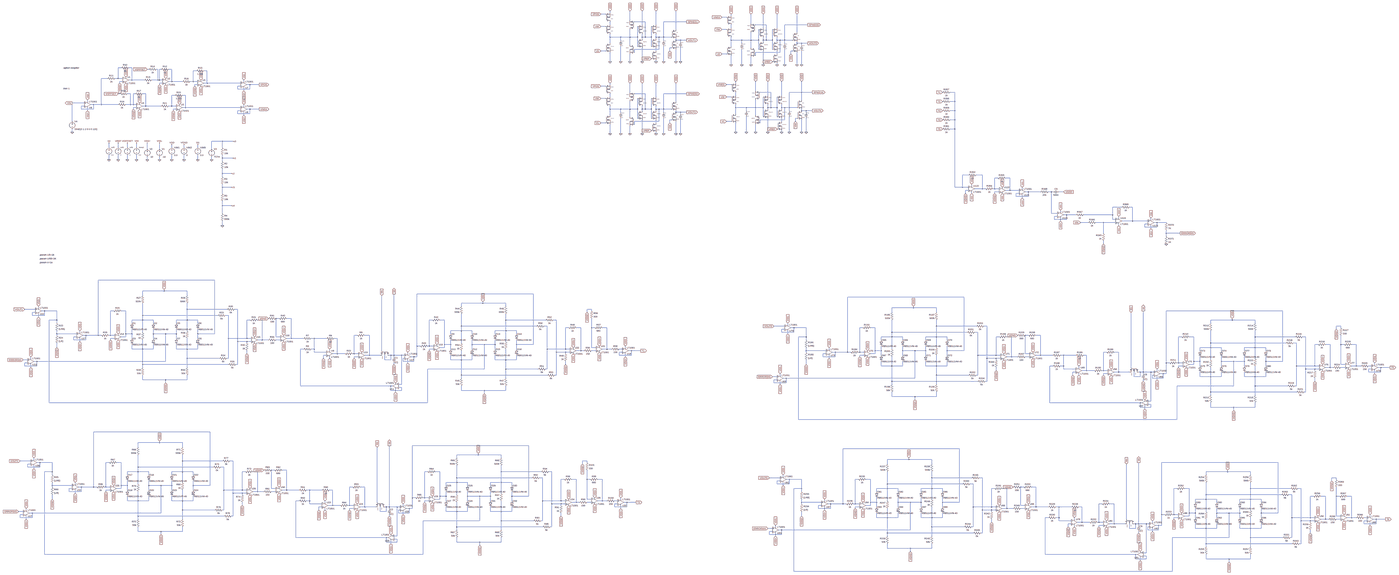
[diagram p0: schematic OZ_8_bounded_curves.asc, whole sheet]
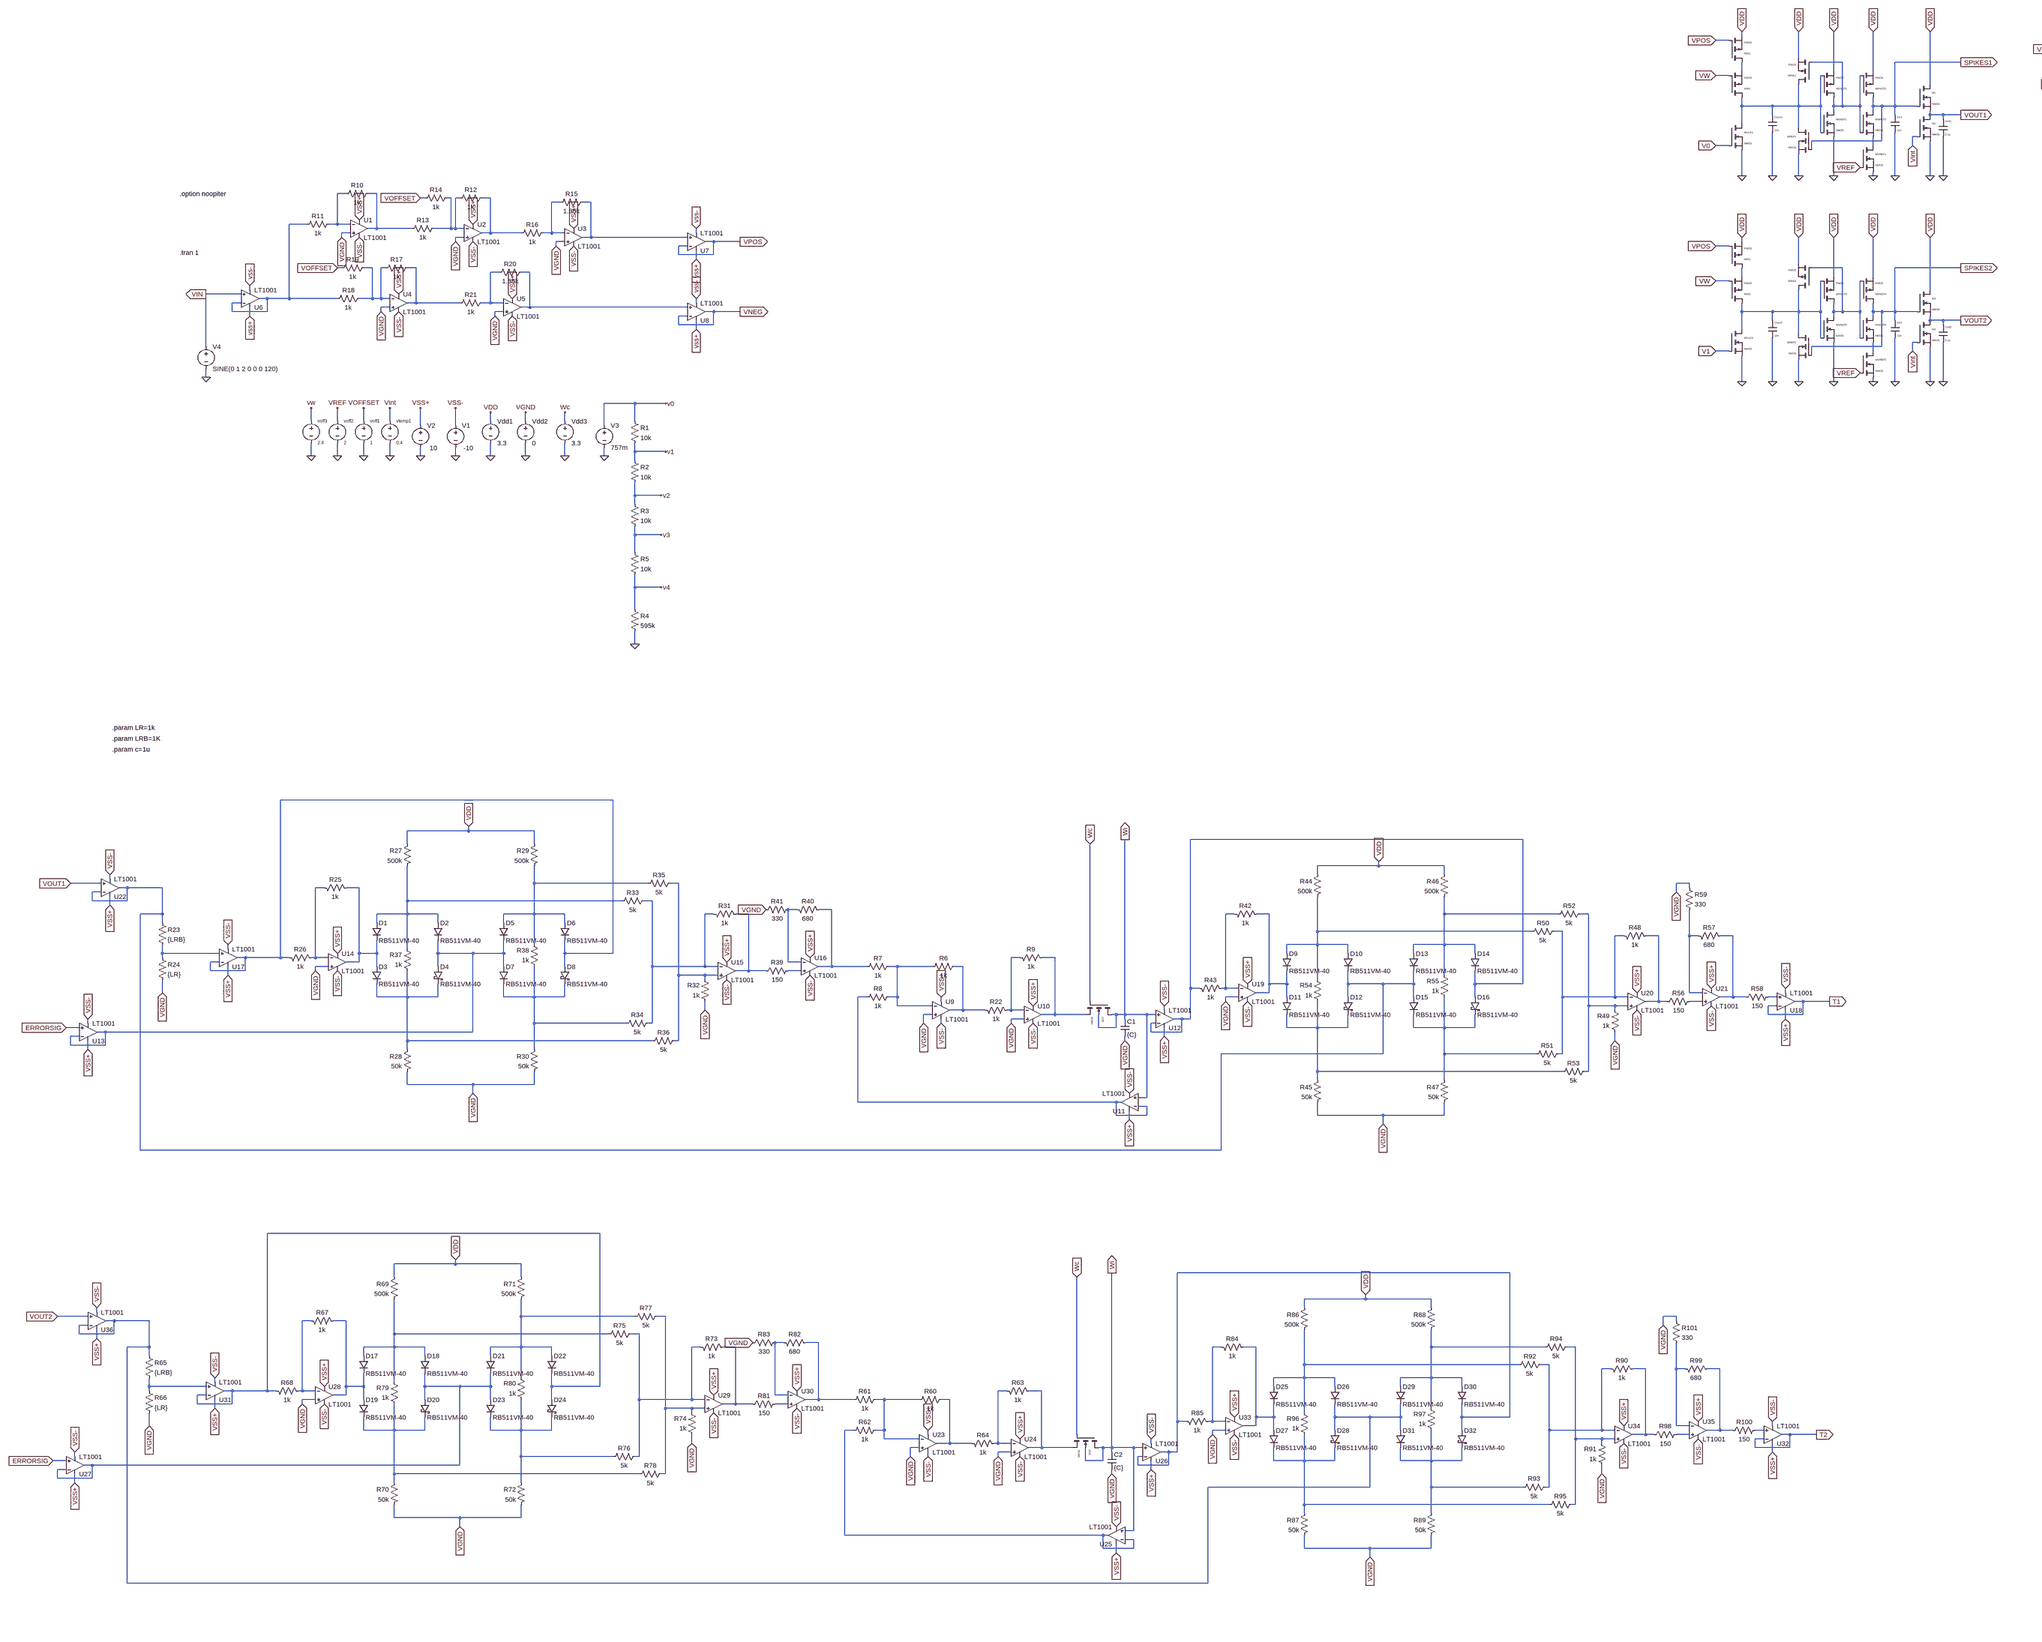
[diagram p1: schematic OZ_8_bounded_curves.asc, part, row 1 of 1, column 1 of 2]
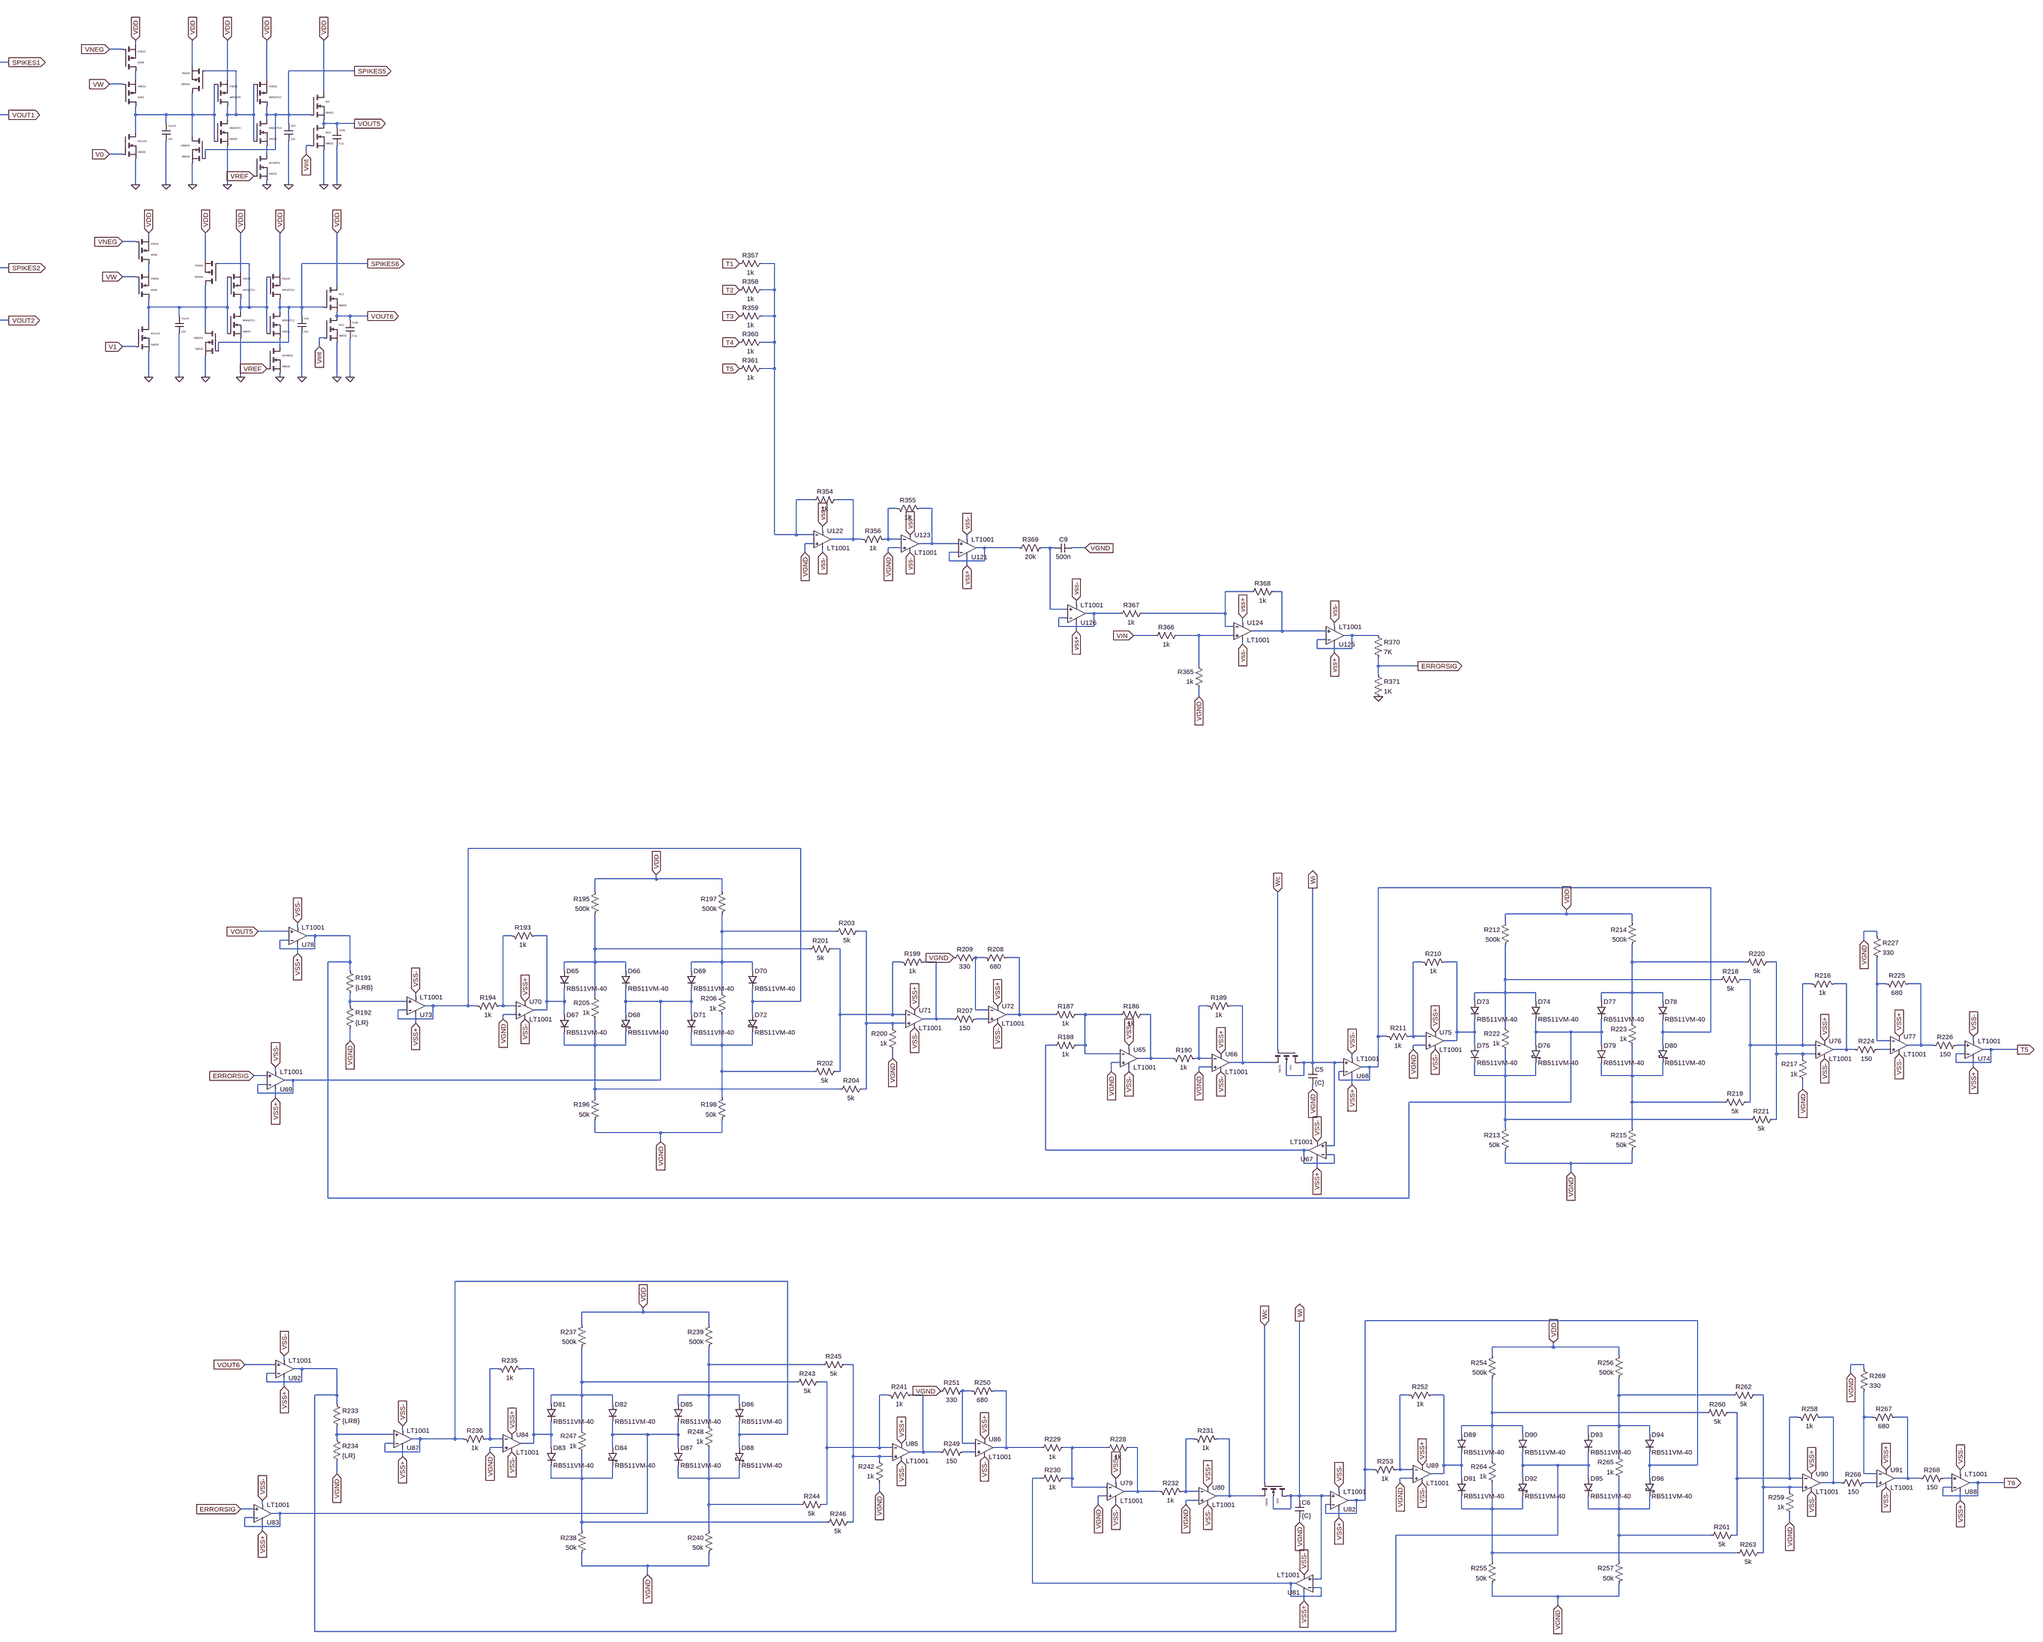
[diagram p2: schematic OZ_8_bounded_curves.asc, part, row 1 of 1, column 2 of 2]
* OZ_8_bounded_curves.asc
vtemp1 Vint 0 0.4
Vdd1 VDD 0 3.3
V1 VSS- 0 -10
V2 VSS+ 0 10
voff1 VOFFSET 0 1
voff2 VREF 0 2
voff3 vw 0 2.4
Vdd2 VGND 0 0
XU1 VGND N009 VSS+ VSS- N010 LT1001  ; pins In+ In- V+ V- OUT
R10 N010 N009 1k
R11 N009 N015 1k
XU2 VGND N011 VSS+ VSS- N012 LT1001  ; pins In+ In- V+ V- OUT
R12 N012 N011 1k
R13 N011 N010 1k
R14 N011 VOFFSET 1k
XU3 VGND N013 VSS+ VSS- N014 LT1001  ; pins In+ In- V+ V- OUT
R15 N014 N013 1.65k
R16 N013 N012 1k
XU4 VGND N018 VSS+ VSS- N019 LT1001  ; pins In+ In- V+ V- OUT
R17 N019 N018 1k
R18 N018 N015 1k
R19 N018 VOFFSET 1k
XU5 VGND N021 VSS+ VSS- N022 LT1001  ; pins In+ In- V+ V- OUT
R20 N022 N021 1.65k
R21 N021 N019 1k
XU6 VIN N015 VSS+ VSS- N015 LT1001  ; pins In+ In- V+ V- OUT
XU7 N014 VPOS VSS+ VSS- VPOS LT1001  ; pins In+ In- V+ V- OUT
XU8 N022 VNEG VSS+ VSS- VNEG LT1001  ; pins In+ In- V+ V- OUT
MW1 N005 vw N002 N002 PMOS
Csyn1 N005 0 10n V=4 Irms=162m Rser=0.395426 Lser=0 mfg="KEMET" pn="C0402C103K7PAC" type="X5R" IC=0
Ck1 SPIKES1 0 10n
MPNOT1 N001 N005 VDD VDD PMOS
MNNOT1 N001 N005 0 0 NMOS
MVREF1 N007 VREF 0 0 NMOS
MREF1 N005 SPIKES1 0 0 NMOS
MVLK1 N005 V0 0 0 NMOS
MINA1 N005 N001 VDD VDD PMOS
MIN1 N002 VPOS VDD VDD PMOS
MPNOT2 SPIKES1 N001 VDD VDD PMOS
MNNOT2 SPIKES1 N001 N007 N007 NMOS
M1 VDD SPIKES1 VOUT1 VOUT1 NMOS
M2 VOUT1 Vint 0 0 NMOS
Cint1 VOUT1 0 0.1µ
MW2 N026 vw N024 N024 PMOS
Csyn2 N026 0 10n V=4 Irms=162m Rser=0.395426 Lser=0 mfg="KEMET" pn="C0402C103K7PAC" type="X5R" IC=0
Ck2 SPIKES2 0 10n
MPNOT3 N020 N026 VDD VDD PMOS
MNNOT3 N020 N026 0 0 NMOS
MVREF2 N028 VREF 0 0 NMOS
MREF2 N026 SPIKES2 0 0 NMOS
MVLK2 N026 V1 0 0 NMOS
MINA2 N026 N020 VDD VDD PMOS
MIN2 N024 VPOS VDD VDD PMOS
MPNOT4 SPIKES2 N020 VDD VDD PMOS
MNNOT4 SPIKES2 N020 N028 N028 NMOS
M3 VDD SPIKES2 VOUT2 VOUT2 NMOS
M4 VOUT2 Vint 0 0 NMOS
Cint2 VOUT2 0 0.1µ
MW5 N006 vw N004 N004 PMOS
Csyn5 N006 0 10n V=4 Irms=162m Rser=0.395426 Lser=0 mfg="KEMET" pn="C0402C103K7PAC" type="X5R" IC=0
Ck5 SPIKES5 0 10n
MPNOT9 N003 N006 VDD VDD PMOS
MNNOT9 N003 N006 0 0 NMOS
MVREF5 N008 VREF 0 0 NMOS
MREF5 N006 SPIKES5 0 0 NMOS
MVLK5 N006 V0 0 0 NMOS
MINA5 N006 N003 VDD VDD PMOS
MIN5 N004 VNEG VDD VDD PMOS
MPNOT10 SPIKES5 N003 VDD VDD PMOS
MNNOT10 SPIKES5 N003 N008 N008 NMOS
M9 VDD SPIKES5 VOUT5 VOUT5 NMOS
M10 VOUT5 Vint 0 0 NMOS
Cint5 VOUT5 0 0.1µ
MW6 N025 vw N023 N023 PMOS
Csyn6 N025 0 10n V=4 Irms=162m Rser=0.395426 Lser=0 mfg="KEMET" pn="C0402C103K7PAC" type="X5R" IC=0
Ck6 SPIKES6 0 10n
MPNOT11 N016 N025 VDD VDD PMOS
MNNOT11 N016 N025 0 0 NMOS
MVREF6 N027 VREF 0 0 NMOS
MREF6 N025 SPIKES6 0 0 NMOS
MVLK6 N025 V1 0 0 NMOS
MINA6 N025 N016 VDD VDD PMOS
MIN6 N023 VNEG VDD VDD PMOS
MPNOT12 SPIKES6 N016 VDD VDD PMOS
MNNOT12 SPIKES6 N016 N027 N027 NMOS
M11 VDD SPIKES6 VOUT6 VOUT6 NMOS
M12 VOUT6 Vint 0 0 NMOS
Cint6 VOUT6 0 0.1µ
V3 V0 0 757m
R1 V0 V1 10k
R2 V1 v2 10k
R3 v2 v3 10k
R4 v4 0 595k
R5 v3 v4 10k
V4 VIN 0 SINE(0 1 2 0 0 0 120)
XU121 N031 N032 VSS+ VSS- N032 LT1001  ; pins In+ In- V+ V- OUT
XU122 VGND N017 VSS+ VSS- N029 LT1001  ; pins In+ In- V+ V- OUT
R354 N029 N017 1k
XU123 VGND N030 VSS+ VSS- N031 LT1001  ; pins In+ In- V+ V- OUT
R355 N030 N031 1k
R356 N029 N030 1k
R357 N017 T1 1k
R358 N017 T2 1k
R359 N017 T3 1k
R360 N017 T4 1k
R361 N017 T5 1k
M17 Wi Wc N072 Wi NMOS
C1 Wi VGND {C} IC=0
XU9 VGND N080 VSS+ VSS- N081 LT1001  ; pins In+ In- V+ V- OUT
R6 N081 N080 1k
R7 N080 N051 1k
R8 N080 N090 1k
XU10 VGND N071 VSS+ VSS- N072 LT1001  ; pins In+ In- V+ V- OUT
R9 N071 N072 1k
R22 N081 N071 1k
XU11 Wi N090 VSS+ VSS- N090 LT1001  ; pins In+ In- V+ V- OUT
XU12 Wi N040 VSS+ VSS- N040 LT1001  ; pins In+ In- V+ V- OUT
R23 N044 N069 {LRB}
R24 N069 VGND {LR}
XU13 ERRORSIG N070 VSS+ VSS- N070 LT1001  ; pins In+ In- V+ V- OUT
D1 N048 N046 RB511VM-40
XU14 VGND N045 VSS+ VSS- N046 LT1001  ; pins In+ In- V+ V- OUT
R25 N045 N046 1k
R26 N039 N045 1k
D2 N048 N070 RB511VM-40
D3 N046 N088 RB511VM-40
D4 N070 N088 RB511VM-40
R27 VDD N048 500k
R28 N088 VGND 50k
D5 N042 N070 RB511VM-40
D6 N042 N039 RB511VM-40
D7 N070 N089 RB511VM-40
D8 N039 N089 RB511VM-40
R29 VDD N042 500k
R30 N089 VGND 50k
XU15 N043 N049 VSS+ VSS- N052 LT1001  ; pins In+ In- V+ V- OUT
R31 N049 N052 1k
R32 VGND N043 1k
R33 N049 N048 5k
R34 N049 N089 5k
R35 N043 N042 5k
R36 N043 N088 5k
R37 N088 N048 1k
R38 N089 N042 1k
R39 N052 N082 150
XU16 N082 N050 VSS+ VSS- N051 LT1001  ; pins In+ In- V+ V- OUT
R40 N050 N051 680
R41 VGND N050 330
XU17 N069 N039 VSS+ VSS- N039 LT1001  ; pins In+ In- V+ V- OUT
XU18 N091 T1 VSS+ VSS- T1 LT1001  ; pins In+ In- V+ V- OUT
D9 N057 N054 RB511VM-40
XU19 VGND N053 VSS+ VSS- N054 LT1001  ; pins In+ In- V+ V- OUT
R42 N053 N054 1k
R43 N040 N053 1k
D10 N057 N044 RB511VM-40
D11 N054 N100 RB511VM-40
D12 N044 N100 RB511VM-40
R44 VDD N057 500k
R45 N100 VGND 50k
D13 N055 N044 RB511VM-40
D14 N055 N040 RB511VM-40
D15 N044 N101 RB511VM-40
D16 N040 N101 RB511VM-40
R46 VDD N055 500k
R47 N101 VGND 50k
XU20 N056 N058 VSS+ VSS- N061 LT1001  ; pins In+ In- V+ V- OUT
R48 N058 N061 1k
R49 VGND N056 1k
R50 N058 N057 5k
R51 N058 N101 5k
R52 N056 N055 5k
R53 N056 N100 5k
R54 N100 N057 1k
R55 N101 N055 1k
R56 N061 N092 150
XU21 N092 N062 VSS+ VSS- N063 LT1001  ; pins In+ In- V+ V- OUT
R57 N062 N063 680
R58 N063 N091 150
R59 VGND N062 330
XU22 VOUT1 N044 VSS+ VSS- N044 LT1001  ; pins In+ In- V+ V- OUT
M18 Wi Wc N142 Wi NMOS
C2 Wi VGND {C} IC=0
XU23 VGND N150 VSS+ VSS- N151 LT1001  ; pins In+ In- V+ V- OUT
R60 N151 N150 1k
R61 N150 N121 1k
R62 N150 N160 1k
XU24 VGND N141 VSS+ VSS- N142 LT1001  ; pins In+ In- V+ V- OUT
R63 N141 N142 1k
R64 N151 N141 1k
XU25 Wi N160 VSS+ VSS- N160 LT1001  ; pins In+ In- V+ V- OUT
XU26 Wi N110 VSS+ VSS- N110 LT1001  ; pins In+ In- V+ V- OUT
R65 N114 N139 {LRB}
R66 N139 VGND {LR}
XU27 ERRORSIG N140 VSS+ VSS- N140 LT1001  ; pins In+ In- V+ V- OUT
D17 N118 N116 RB511VM-40
XU28 VGND N115 VSS+ VSS- N116 LT1001  ; pins In+ In- V+ V- OUT
R67 N115 N116 1k
R68 N109 N115 1k
D18 N118 N140 RB511VM-40
D19 N116 N158 RB511VM-40
D20 N140 N158 RB511VM-40
R69 VDD N118 500k
R70 N158 VGND 50k
D21 N112 N140 RB511VM-40
D22 N112 N109 RB511VM-40
D23 N140 N159 RB511VM-40
D24 N109 N159 RB511VM-40
R71 VDD N112 500k
R72 N159 VGND 50k
XU29 N113 N119 VSS+ VSS- N122 LT1001  ; pins In+ In- V+ V- OUT
R73 N119 N122 1k
R74 VGND N113 1k
R75 N119 N118 5k
R76 N119 N159 5k
R77 N113 N112 5k
R78 N113 N158 5k
R79 N158 N118 1k
R80 N159 N112 1k
R81 N122 N152 150
XU30 N152 N120 VSS+ VSS- N121 LT1001  ; pins In+ In- V+ V- OUT
R82 N120 N121 680
R83 VGND N120 330
XU31 N139 N109 VSS+ VSS- N109 LT1001  ; pins In+ In- V+ V- OUT
XU32 N161 T2 VSS+ VSS- T2 LT1001  ; pins In+ In- V+ V- OUT
D25 N127 N124 RB511VM-40
XU33 VGND N123 VSS+ VSS- N124 LT1001  ; pins In+ In- V+ V- OUT
R84 N123 N124 1k
R85 N110 N123 1k
D26 N127 N114 RB511VM-40
D27 N124 N170 RB511VM-40
D28 N114 N170 RB511VM-40
R86 VDD N127 500k
R87 N170 VGND 50k
D29 N125 N114 RB511VM-40
D30 N125 N110 RB511VM-40
D31 N114 N171 RB511VM-40
D32 N110 N171 RB511VM-40
R88 VDD N125 500k
R89 N171 VGND 50k
XU34 N126 N128 VSS+ VSS- N131 LT1001  ; pins In+ In- V+ V- OUT
R90 N128 N131 1k
R91 VGND N126 1k
R92 N128 N127 5k
R93 N128 N171 5k
R94 N126 N125 5k
R95 N126 N170 5k
R96 N170 N127 1k
R97 N171 N125 1k
R98 N131 N162 150
XU35 N162 N132 VSS+ VSS- N133 LT1001  ; pins In+ In- V+ V- OUT
R99 N132 N133 680
R100 N133 N161 150
R101 VGND N132 330
XU36 VOUT2 N114 VSS+ VSS- N114 LT1001  ; pins In+ In- V+ V- OUT
M21 Wi Wc N096 Wi NMOS
C5 Wi VGND {C} IC=0
XU65 VGND N097 VSS+ VSS- N098 LT1001  ; pins In+ In- V+ V- OUT
R186 N098 N097 1k
R187 N097 N074 1k
R188 N097 N104 1k
XU66 VGND N095 VSS+ VSS- N096 LT1001  ; pins In+ In- V+ V- OUT
R189 N095 N096 1k
R190 N098 N095 1k
XU67 Wi N104 VSS+ VSS- N104 LT1001  ; pins In+ In- V+ V- OUT
XU68 Wi N047 VSS+ VSS- N047 LT1001  ; pins In+ In- V+ V- OUT
R191 N064 N093 {LRB}
R192 N093 VGND {LR}
XU69 ERRORSIG N094 VSS+ VSS- N094 LT1001  ; pins In+ In- V+ V- OUT
D65 N067 N066 RB511VM-40
XU70 VGND N065 VSS+ VSS- N066 LT1001  ; pins In+ In- V+ V- OUT
R193 N065 N066 1k
R194 N041 N065 1k
D66 N067 N094 RB511VM-40
D67 N066 N102 RB511VM-40
D68 N094 N102 RB511VM-40
R195 VDD N067 500k
R196 N102 VGND 50k
D69 N059 N094 RB511VM-40
D70 N059 N041 RB511VM-40
D71 N094 N103 RB511VM-40
D72 N041 N103 RB511VM-40
R197 VDD N059 500k
R198 N103 VGND 50k
XU71 N060 N068 VSS+ VSS- N075 LT1001  ; pins In+ In- V+ V- OUT
R199 N068 N075 1k
R200 VGND N060 1k
R201 N068 N067 5k
R202 N068 N103 5k
R203 N060 N059 5k
R204 N060 N102 5k
R205 N102 N067 1k
R206 N103 N059 1k
R207 N075 N099 150
XU72 N099 N073 VSS+ VSS- N074 LT1001  ; pins In+ In- V+ V- OUT
R208 N073 N074 680
R209 VGND N073 330
XU73 N093 N041 VSS+ VSS- N041 LT1001  ; pins In+ In- V+ V- OUT
XU74 N105 T5 VSS+ VSS- T5 LT1001  ; pins In+ In- V+ V- OUT
D73 N083 N077 RB511VM-40
XU75 VGND N076 VSS+ VSS- N077 LT1001  ; pins In+ In- V+ V- OUT
R210 N076 N077 1k
R211 N047 N076 1k
D74 N083 N064 RB511VM-40
D75 N077 N107 RB511VM-40
D76 N064 N107 RB511VM-40
R212 VDD N083 500k
R213 N107 VGND 50k
D77 N078 N064 RB511VM-40
D78 N078 N047 RB511VM-40
D79 N064 N108 RB511VM-40
D80 N047 N108 RB511VM-40
R214 VDD N078 500k
R215 N108 VGND 50k
XU76 N079 N084 VSS+ VSS- N085 LT1001  ; pins In+ In- V+ V- OUT
R216 N084 N085 1k
R217 VGND N079 1k
R218 N084 N083 5k
R219 N084 N108 5k
R220 N079 N078 5k
R221 N079 N107 5k
R222 N107 N083 1k
R223 N108 N078 1k
R224 N085 N106 150
XU77 N106 N086 VSS+ VSS- N087 LT1001  ; pins In+ In- V+ V- OUT
R225 N086 N087 680
R226 N087 N105 150
R227 VGND N086 330
XU78 VOUT5 N064 VSS+ VSS- N064 LT1001  ; pins In+ In- V+ V- OUT
M22 Wi Wc N166 Wi NMOS
C6 Wi VGND {C} IC=0
XU79 VGND N167 VSS+ VSS- N168 LT1001  ; pins In+ In- V+ V- OUT
R228 N168 N167 1k
R229 N167 N144 1k
R230 N167 N174 1k
XU80 VGND N165 VSS+ VSS- N166 LT1001  ; pins In+ In- V+ V- OUT
R231 N165 N166 1k
R232 N168 N165 1k
XU81 Wi N174 VSS+ VSS- N174 LT1001  ; pins In+ In- V+ V- OUT
XU82 Wi N117 VSS+ VSS- N117 LT1001  ; pins In+ In- V+ V- OUT
R233 N134 N163 {LRB}
R234 N163 VGND {LR}
XU83 ERRORSIG N164 VSS+ VSS- N164 LT1001  ; pins In+ In- V+ V- OUT
D81 N137 N136 RB511VM-40
XU84 VGND N135 VSS+ VSS- N136 LT1001  ; pins In+ In- V+ V- OUT
R235 N135 N136 1k
R236 N111 N135 1k
D82 N137 N164 RB511VM-40
D83 N136 N172 RB511VM-40
D84 N164 N172 RB511VM-40
R237 VDD N137 500k
R238 N172 VGND 50k
D85 N129 N164 RB511VM-40
D86 N129 N111 RB511VM-40
D87 N164 N173 RB511VM-40
D88 N111 N173 RB511VM-40
R239 VDD N129 500k
R240 N173 VGND 50k
XU85 N130 N138 VSS+ VSS- N145 LT1001  ; pins In+ In- V+ V- OUT
R241 N138 N145 1k
R242 VGND N130 1k
R243 N138 N137 5k
R244 N138 N173 5k
R245 N130 N129 5k
R246 N130 N172 5k
R247 N172 N137 1k
R248 N173 N129 1k
R249 N145 N169 150
XU86 N169 N143 VSS+ VSS- N144 LT1001  ; pins In+ In- V+ V- OUT
R250 N143 N144 680
R251 VGND N143 330
XU87 N163 N111 VSS+ VSS- N111 LT1001  ; pins In+ In- V+ V- OUT
XU88 N175 T6 VSS+ VSS- T6 LT1001  ; pins In+ In- V+ V- OUT
D89 N153 N147 RB511VM-40
XU89 VGND N146 VSS+ VSS- N147 LT1001  ; pins In+ In- V+ V- OUT
R252 N146 N147 1k
R253 N117 N146 1k
D90 N153 N134 RB511VM-40
D91 N147 N177 RB511VM-40
D92 N134 N177 RB511VM-40
R254 VDD N153 500k
R255 N177 VGND 50k
D93 N148 N134 RB511VM-40
D94 N148 N117 RB511VM-40
D95 N134 N178 RB511VM-40
D96 N117 N178 RB511VM-40
R256 VDD N148 500k
R257 N178 VGND 50k
XU90 N149 N154 VSS+ VSS- N155 LT1001  ; pins In+ In- V+ V- OUT
R258 N154 N155 1k
R259 VGND N149 1k
R260 N154 N153 5k
R261 N154 N178 5k
R262 N149 N148 5k
R263 N149 N177 5k
R264 N177 N153 1k
R265 N178 N148 1k
R266 N155 N176 150
XU91 N176 N156 VSS+ VSS- N157 LT1001  ; pins In+ In- V+ V- OUT
R267 N156 N157 680
R268 N157 N175 150
R269 VGND N156 330
XU92 VOUT6 N134 VSS+ VSS- N134 LT1001  ; pins In+ In- V+ V- OUT
XU124 N037 N034 VSS+ VSS- N035 LT1001  ; pins In+ In- V+ V- OUT
R365 VGND N037 1k
R366 N037 VIN 1k
R367 N034 N036 1k
R368 N035 N034 1k
XU125 N035 N038 VSS+ VSS- N038 LT1001  ; pins In+ In- V+ V- OUT
R369 N032 N033 20k
C9 N033 VGND 500n
XU126 N033 N036 VSS+ VSS- N036 LT1001  ; pins In+ In- V+ V- OUT
R370 N038 ERRORSIG 7K
R371 ERRORSIG 0 1K
Vdd3 Wc 0 3.3
.model D D
.lib standard.dio
.model NMOS NMOS
.model PMOS PMOS
.lib standard.mos
.tran 1
.option noopiter
.param LR=1k
.param LRB=1K
.param c=1u
.lib LTC.lib
.backanno
.end